# EAGLE design waterius-factory (EAGLE 9.0.1)
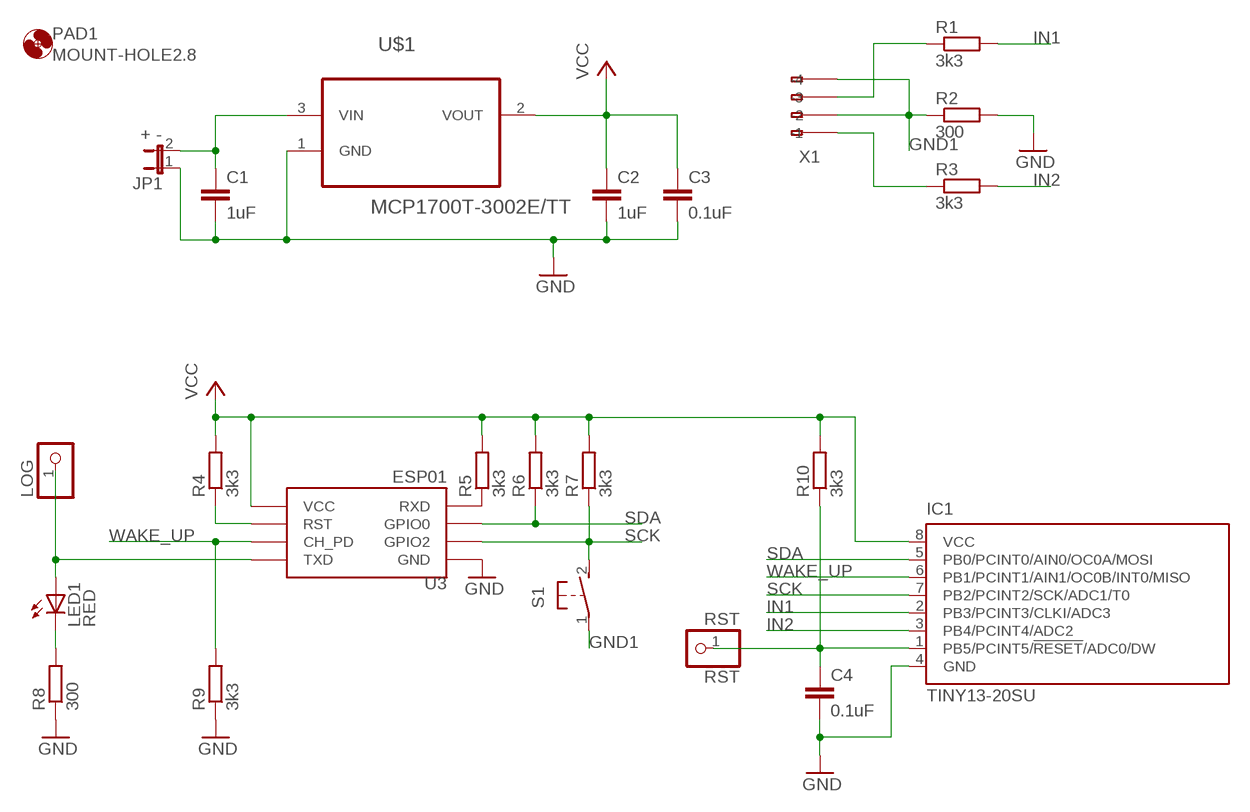
[diagram p0: schematic, sheet 1]

## Parts
C1  1uF  C-EUC0805  [C0805]
C2  1uF  C-EUC0805  [C0805]
C3  0.1uF  C-EUC0805  [C0805]
C4  0.1uF  C-EUC0805  [C0805]
IC1  TINY13-20SU  [8S2]
JP1  + -  JP1E  [JP1]
LED1  RED  LED3MM  [LED3MM]
LOG  PINHD-1X1  [1X01]
PAD1  MOUNT-HOLE2.8  [2,8]
R1  3k3  R-EU_R0805  [R0805]
R2  300  R-EU_R0805  [R0805]
R3  3k3  R-EU_R0805  [R0805]
R4  3k3  R-EU_R0805  [R0805]
R5  3k3  R-EU_R0805  [R0805]
R6  3k3  R-EU_R0805  [R0805]
R7  3k3  R-EU_R0805  [R0805]
R8  300  R-EU_R0805  [R0805]
R9  3k3  R-EU_R0805  [R0805]
R10  3k3  R-EU_R0805  [R0805]
RST  RST  PINHD-1X1  [1X01]
S1  31-XX  [B3F-31XX]
U3  ESP01  [ESP01]
U$1  MCP1700T-3002E/TT  [SOT95P237X112-3N]
X1  233-104  [233-104]

## Nets
+3V: C2.1 C3.1 IC1.8(VCC) R4.2 R5.2 R6.2 R7.2 R10.2 U3.VCC U$1.2(VOUT) ; supply symbol labelled VCC
GND: C1.2 C2.2 C3.2 C4.2 IC1.4(GND) JP1.1 R2.2 R8.1 R9.1 U3.GND U$1.1(GND)
GND1: R2.1 S1.1(P) X1.A2(-2) X1.A4(-4)
IN1: IC1.2(PB3/PCINT3/CLKI/ADC3) R1.2
IN2: IC1.3(PB4/PCINT4/ADC2) R3.2
N$1: C1.1 JP1.2 U$1.3(VIN)
N$2: R5.1 U3.RX(RXD)
N$3: R4.1 U3.RST
N$4: C4.1 IC1.1(PB5/PCINT5/!RESET!/ADC0/DW) R10.1 RST.1
N$5: LED1.A LOG.1 U3.TX(TXD)
N$6: LED1.K(C) R8.2
N$7: R1.1 X1.A3(-3)
N$8: R3.1 X1.A1(-1)
SCK: IC1.7(PB2/PCINT2/SCK/ADC1/T0) R7.1 S1.2(S) U3.GPIO2
SDA: IC1.5(PB0/PCINT0/AIN0/OC0A/MOSI) R6.1 U3.GPIO0
WAKE_UP: IC1.6(PB1/PCINT1/AIN1/OC0B/INT0/MISO) R9.2 U3.CH_PD
Unconnected: X1.B1(B-1) X1.B2(B-2) X1.B3(B-3) X1.B4(B-4)

## Library data of the parts
C1-C4 = rcl:C-EU: CAPACITOR, European symbol; SPICEPREFIX: C
IC1 = atmel:TINY13: 8-bit AVR Microcontroller with 1K Bytes In-System Programmable Flash Source: http://www.atmel.com/dyn/resources/prod_documents/2535S.pdf; MPN: ATTINY13-20SU; OC_FARNELL: 9171568; OC_NEWARK: 96K6522
JP1 = jumper:JP1E: JUMPER
LED1 = led:LED: LED OSRAM: - CHIPLED LG R971, LG N971, LY N971, LG Q971, LY Q971, LO R971, LY R971 LH N974, LH R974 LS Q976, LO Q976, LY Q976 LO Q996 - Hyper CHIPLED LW Q18S LB Q993, LB Q99A, LB R99A - SideLED LS A670, LO A670, LY A670, LG A670, LP A670 LB A673, LV A673, LT A673, LW A673 LH A674 LY A675 LS A676, LA A676, LO A676, LY A676, LW A676 LS A679, LY A679, LG A679 - Hyper Micro SIDELED® LS Y876, LA Y876, LO Y876, LY Y876 LT Y87S - SmartLED LW L88C, LW L88S LB L89C, LB L89S, LG L890 LS L89K, LO L89K, LY L89K LS L896, LA L896, LO L896, LY L896 - TOPLED LS T670, LO T670, LY T670, LG T670, LP T670 LSG T670, LSP T670, LSY T670, LOP T670, LYG T670 LG T671, LOG T671, LSG T671 LB T673, LV T673, LT T673, LW T673 LH T674 LS T676, LA T676, LO T676, LY T676, LB T676, LH T676, LSB T676, LW T676 LB T67C, LV T67C, LT T67C, LS T67K, LO T67K, LY T67K, LW E67C LS E67B, LA E67B, LO E67B, LY E67B, LB E67C, LV E67C, LT E67C LW T67C LS T679, LY T679, LG T679 LS T770, LO T770, LY T770, LG T770, LP T770 LB T773, LV T773, LT T773, LW T773 LH T774 LS E675, LA E675, LY E675, LS T675 LS T776, LA T776, LO T776, LY T776, LB T776 LHGB T686 LT T68C, LB T68C - Hyper Mini TOPLED® LB M676 - Mini TOPLED Santana® LG M470 LS M47K, LO M47K, LY M47K Source: http://www.osram.convergy.de LUXEON: - LUMILED® LXK2-PW12-R00, LXK2-PW12-S00, LXK2-PW14-U00, LXK2-PW14-V00 LXK2-PM12-R00, LXK2-PM12-S00, LXK2-PM14-U00 LXK2-PE12-Q00, LXK2-PE12-R00, LXK2-PE12-S00, LXK2-PE14-T00, LXK2-PE14-U00 LXK2-PB12-K00, LXK2-PB12-L00, LXK2-PB12-M00, LXK2-PB14-N00, LXK2-PB14-P00, LXK2-PB14-Q00 LXK2-PR12-L00, LXK2-PR12-M00, LXK2-PR14-Q00, LXK2-PR14-R00 LXK2-PD12-Q00, LXK2-PD12-R00, LXK2-PD12-S00 LXK2-PH12-R00, LXK2-PH12-S00 LXK2-PL12-P00, LXK2-PL12-Q00, LXK2-PL12-R00 Source: www.luxeon.com KINGBRIGHT: KA-3528ASYC Source: www.kingbright.com
LOG RST = pinhead:PINHD-1X1: PIN HEADER
PAD1 = holes:MOUNT-HOLE: MOUNTING HOLE with drill center marker
R1-R10 = resistor:R-EU_: RESISTOR, European symbol
S1 = switch-omron:31-XX: OMRON SWITCH; MPN: B3F-3100; OC_FARNELL: 959704; OC_NEWARK: 36M3582
U3 = esp8266modules:ESP01: ESP8266 Wifi module 01
U$1 = Microchip_By_element14_Batch_1:MCP1700T-3002E/TT: Low Quiescent Current LDO; MPN: MCP1700T-3002E/TT; OC_FARNELL: 1331482; OC_NEWARK: 84R5176; PACKAGE: SOT23-3; SUPPLIER: Microchip
X1 = con-wago255:233-104: WAGO; MPN: 233-104; OC_FARNELL: unknown; OC_NEWARK: 28K9046

## Net classes
0 default: clearance 0.205 mm

## Board
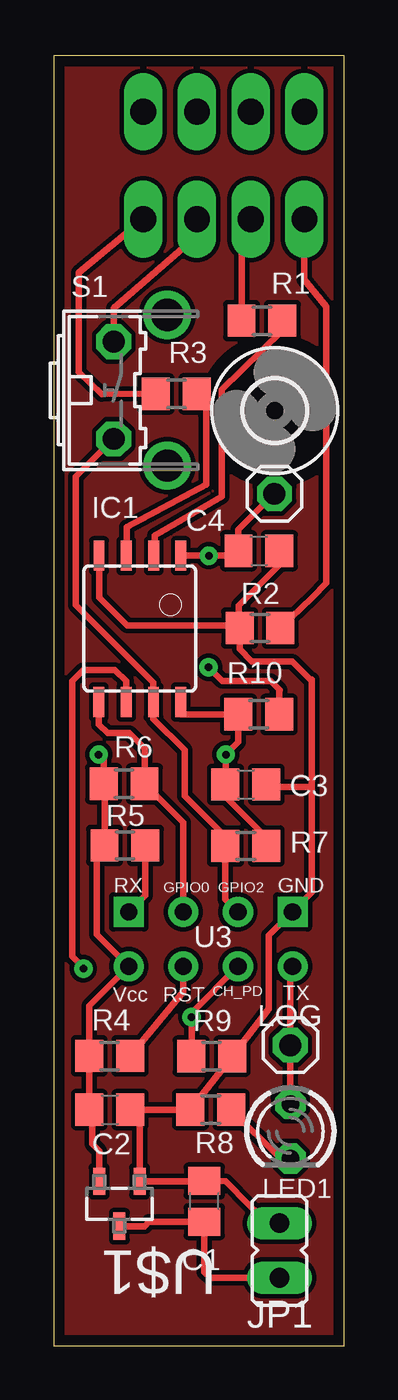
[diagram p1: board, top side]
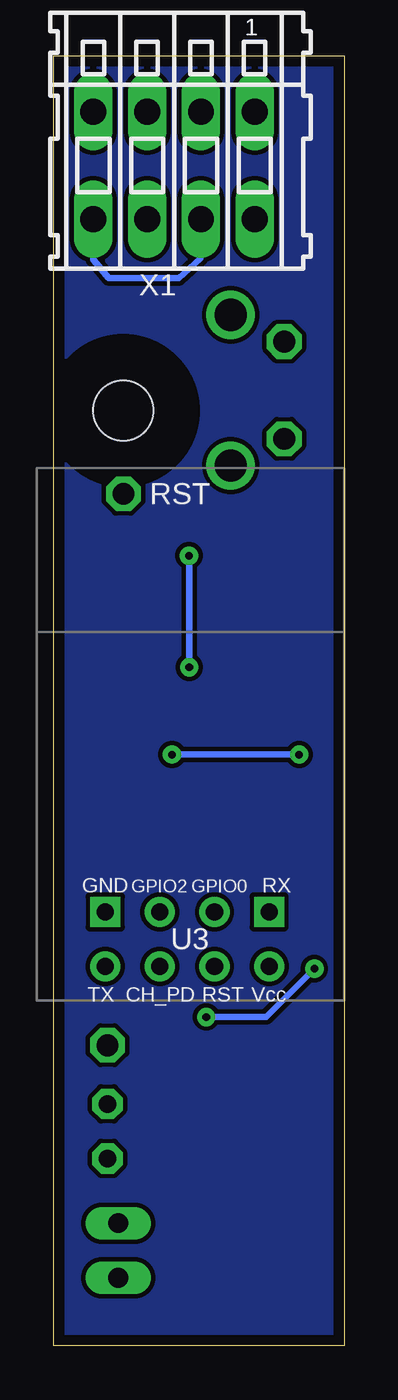
[diagram p2: board, bottom side, seen from below]

Size 13.5 x 60 mm. Coordinates in mm from the lower left corner, seen from the top.
Outline: 0,0 13.5,0 13.5,60 0,60 0,0
Copper layers (1*16): Top 0.035mm / dielectric 1.5mm / Bottom 0.035mm
Design rules "my *": minimum track width 0.25mm, minimum drill 0.3mm, track to track 0.2mm, track to pad 0.2mm, pad to pad 0.2mm, via to via 0.2mm, smd to smd 6mil, copper to edge 0.5mm, drill to drill 0.2mm, minimum pad ring 0.3mm, minimum via ring 0.25mm, stop-mask expansion 4mil, vias tented up to drill 0mil, thermal gap 10mil

### Footprints (pad centres in the part's own frame; a part is rotated, then mirrored left to right if it is on the bottom)
C0805 = smd 1.3 x 1.5: 1 -0.95,0; 2 0.95,0
8S2 = smd 0.5 x 1.4: 1 -1.905,-3.404; 2 -0.645,-3.404; 3 0.625,-3.404; 4 1.895,-3.404; 5 1.905,3.404; 6 0.635,3.404; 7 -0.635,3.404; 8 -1.905,3.404
JP1 = drill 0.914 long: 1 0,-1.27; 2 0,1.27
LED3MM = drill 0.813 octagon: A -1.27,0; K 1.27,0
1X01 = drill 1.016 octagon: 1 0,0
2,8 = hole 2.8: 0,0
R0805 = smd 1.3 x 1.5: 1 -0.95,0; 2 0.95,0
B3F-31XX = drill 1.016 octagon: 1 -2.261,-1.245; 2 2.261,-1.245 | drill 1.499 pad 2.159: 3 -3.505,1.245; 4 3.505,1.245
ESP01 = drill 0.8: CH_PD -1.285,-8.178; GPIO0 1.255,-5.638; GPIO2 -1.285,-5.638; RST 1.255,-8.178; TX -3.825,-8.178; VCC 3.795,-8.178 | drill 0.8 square: GND -3.825,-5.638; RX 3.795,-5.638
SOT95P237X112-3N = smd 0.559 x 1.27: 1 -0.94,-1.041; 2 0.94,-1.041; 3 0,1.041
233-104 = drill 1.2 long: A1 -3.75,2.5; A2 -1.25,2.5; A3 1.25,2.5; A4 3.75,2.5; B1 -3.75,-2.5; B2 -1.25,-2.5; B3 1.25,-2.5; B4 3.75,-2.5

### Placement (x,y rotation side)
C1  7,6.72 90 top
C2  2.6,10.98 0 top
C3  8.93,26.11 0 top
C4  9.54,36.98 0 top
IC1  4,33.35 180 top
JP1  10.5,4.43 180 top
LED1  11,9.98 270 top
LOG  11,13.98 0 top
PAD1  10.27,43.5 0 top
R1  9.68,47.68 0 top
R2  9.59,33.39 180 top
R3  5.7,44.28 0 top
R4  2.6,13.48 180 top
R5  3.31,23.27 180 top
R6  3.27,26.14 180 top
R7  8.93,23.25 0 top
R8  7.3,10.98 0 top
R9  7.34,13.47 180 top
R10  9.53,29.37 180 top
RST  10.26,39.63 0 top
S1  4.03,44.45 270 top
U3  7.28,25.82 0 bottom
U$1  3.05,6.6 180 top
X1  7.91,54.9 180 bottom

### Tracks (layer width: path | path; a pad name or v marks a point on that pad's centre or on a via)
+3V  (via drill 0.35)
  Top 0.305: 2.05,10.58 C2.1 | C2.1 R4.2 1.65,15.81 U3.VCC 2,19.13 2,22.91 R5.2 2.36,26.1 R6.2 2.32,27.27 v2.09,27.5 | IC1.8 5.91,29.62 5.89,29.37 R10.2 8.58,28.08 v8,27.5 8,26.13 C3.1 7.98,25.55 9.88,23.65 | R7.2 9.88,23.65 | 9.88,23.65 9.88,23.83 | U$1.2 2.11,9.07 1.78,9.4 1.78,10.85 C2.1
  Bottom 0.305: v2.09,27.5 v8,27.5
GND
  Top 0.305: JP1.1 9.95,5.71 9.1,6.54 8,7.66 C1.2 6.97,7.64 U$1.1 3.99,10.54 C2.2 | 3.95,10.58 C2.2 | C2.2 R8.1 R9.1 10,15.68 10,19.08 U3.GND 12,21.08 12,26 | 10.35,36.68 10.43,36.7 C4.2 10.49,36.31 8.61,34.43 8.61,33.5 | IC1.4 2.1,34.8 3.41,33.5 8.61,33.5 | 8.61,33.5 R2.2 8.64,32.41 9.21,31.84 11.09,31.84 11.93,31 12,31 12,26 | C3.2 10.14,26 12,26
GND1
  Top 0.305: S1.1 2.79,48.27 6.69,51.66 6.69,52.37 X1.A2 | 12.67,48 12.66,35.47 12.02,34.81 R2.1 | 12.67,48 12.67,48.13 | 12.67,48 12.67,48.33 11.66,49.6 X1.A4
  Bottom 0.305: X1.A2 6.7,50.56 7.69,49.67 10.94,49.67 11.66,50.53 X1.A4
IN1
  Top 0.305: IC1.2 4.7,36.81 4.7,37.68 7.82,39.5 7.82,44.47 10.63,47.23 R1.2
IN2
  Top 0.305: R3.2 7.1,43.74 7.09,40.06 3.4,38.09 IC1.3 3.4,36.78
N$1
  Top 0.305: JP1.2 7.27,3.15 7,3.42 C1.1 4.42,5.76 4.22,5.56 U$1.3
N$2
  Top 0.305: U3.RX 4.26,20.96 R5.1
N$3
  Top 0.305: R4.1 6.03,16.45 U3.RST
N$4  (via drill 0.35)
  Top 0.305: 8.66,36.91 8.55,36.66 | 8.55,36.66 C4.1 8.59,37.96 RST.1 | IC1.1 v7.21,36.75 | v7.21,36.75 8.65,36.75 8.55,36.66 | v7.2,31.56 7.84,30.92 10.08,30.92 10.5,30.5 10.48,30.48 R10.1 | v7.21,36.75
  Bottom 0.305: v7.2,31.56 v7.21,36.75
N$5
  Top 0.305: LED1.A LOG.1 11,17.1 U3.TX
N$6
  Top 0.305: R8.2 10.52,8.71 LED1.K
N$7
  Top 0.305: R1.1 8.73,51.97 X1.A3
N$8
  Top 0.305: X1.A1 1.16,49.92 1.17,45.3 2.23,44.26 R3.1
N$9
  pour Top: 0,0 13.5,0 13.5,60 0,60
N$11
  pour Bottom: 0,0 13,0 13.5,0 13.5,60 13,60 0,60
SCK
  Top 0.305: S1.2 1.03,40.42 1.03,34.45 4.63,30.84 IC1.7 4.63,29.16 6.08,27.71 6.08,25.58 7.98,23.68 R7.1 7.98,20.77 U3.GPIO2
SDA
  Top 0.305: U3.GPIO0 6.03,24.34 R6.1 4.22,27.78 3.5,28.5 2.5,28.5 2.1,28.91 IC1.5
WAKE_UP  (via drill 0.35)
  Top 0.305: 3.4,29.91 IC1.6 3.37,30.91 2.84,31.44 1.37,31.44 0.85,30.92 0.85,18.12 1.38,17.59 v1.38,17.54 | 6.34,14.02 R9.2 6.41,13.99 v6.41,15.29 6.41,15.49 U3.CH_PD
  Bottom 0.305: v1.38,17.54 3.62,15.29 v6.41,15.29

### Text on the board
tNames: RX | GPIO0 | GPIO2 | GND | Vcc | RST | CH_PD | TX
bNames: RX | GPIO0 | GPIO2 | GND | U3 | Vcc | RST | CH_PD | TX